# Altium schematic sheet 00_连接器和电源.SchDoc
size A4
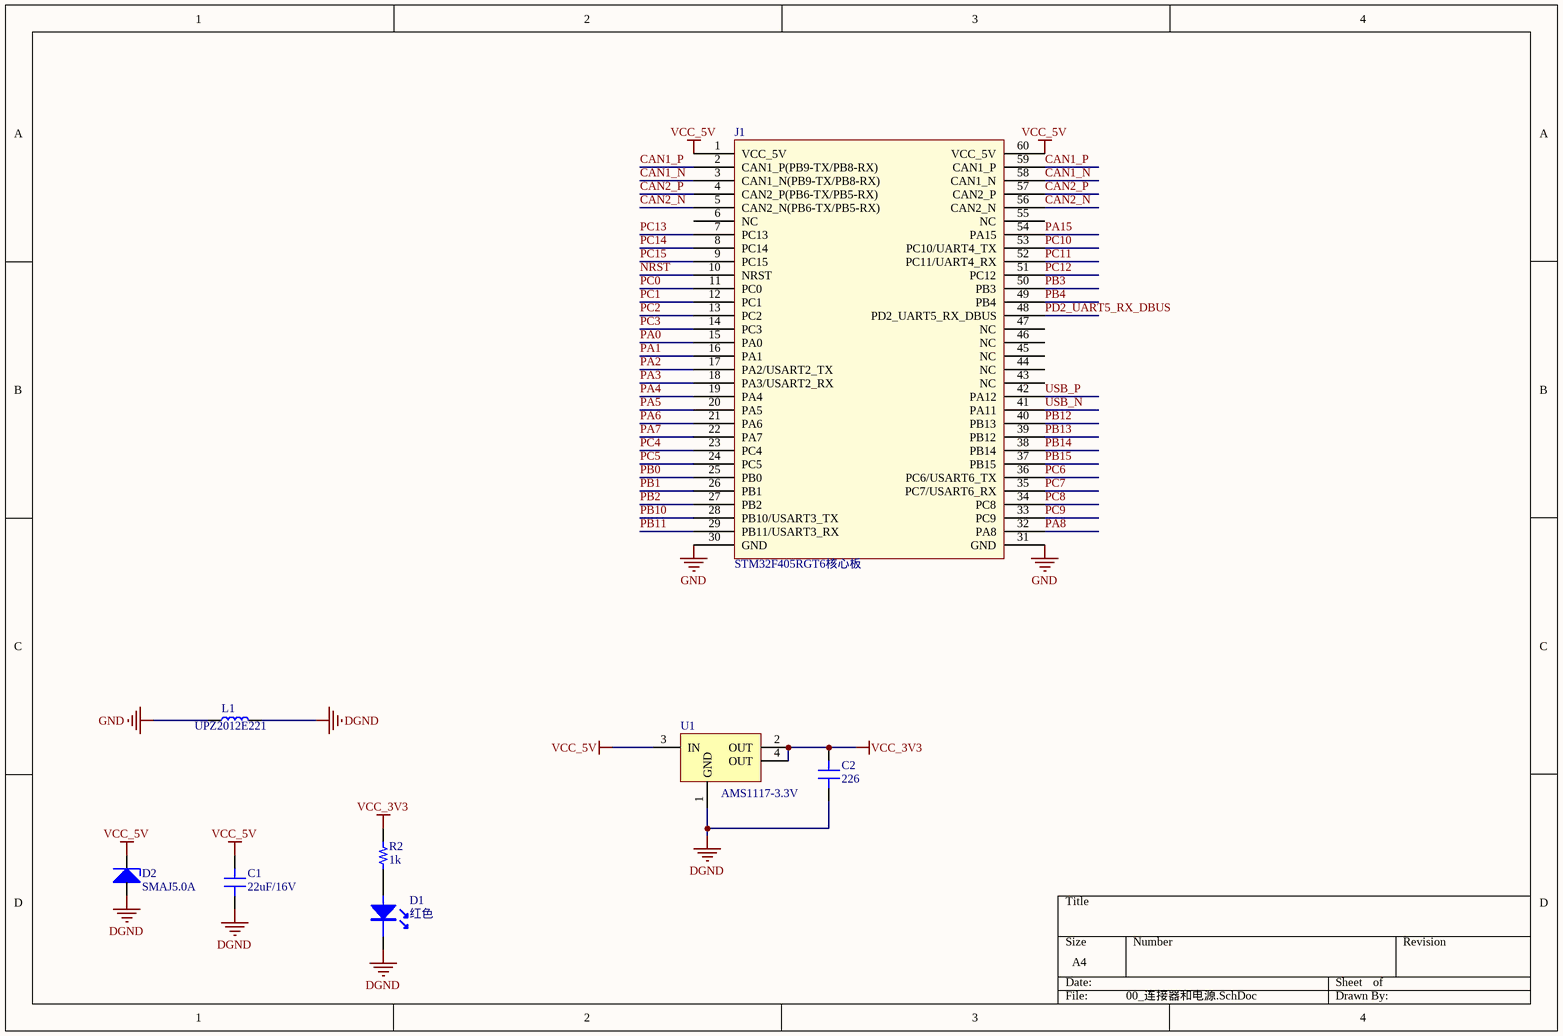
[diagram p0: 00_连接器和电源.SchDoc]

## Parts
C1  22uF/16V  [C1206/3216]
C2  226  [C0603/1608]
D1  Color: 红色  [LED0603-红色]  (hidden comment: LED-红色)
D2  SMAJ5.0A  [DO-214AC/SMA]
J1  STM32F405RGT6核心板  [3710M060037G0FR01]
L1  UPZ2012E221  [L0805/2012]
R2  1k  [R0603/1608]
U1  AMS1117-3.3V  [SOT-223]

## Nets
DGND: C1.1 C2.1 D1.2(K) D2.1(+) L1.2 U1.1(GND)
GND: J1.30(GND) J1.31(GND) L1.1
VCC_3V3: C2.2 R2.2 U1.2(OUT) U1.4(OUT)
VCC_5V: C1.2 D2.2(-) J1.1(VCC_5V) J1.60(VCC_5V) U1.3(IN)
CAN1_N: J1.3(CAN1_N(PB9-TX/PB8-RX)) J1.58(CAN1_N)
CAN1_P: J1.2(CAN1_P(PB9-TX/PB8-RX)) J1.59(CAN1_P)
CAN2_N: J1.5(CAN2_N(PB6-TX/PB5-RX)) J1.56(CAN2_N)
CAN2_P: J1.4(CAN2_P(PB6-TX/PB5-RX)) J1.57(CAN2_P)
NRST: J1.10(NRST)
PA0: J1.15(PA0)
PA1: J1.16(PA1)
PA2: J1.17(PA2/USART2_TX)
PA3: J1.18(PA3/USART2_RX)
PA4: J1.19(PA4)
PA5: J1.20(PA5)
PA6: J1.21(PA6)
PA7: J1.22(PA7)
PA8: J1.32(PA8)
PA15: J1.54(PA15)
PB0: J1.25(PB0)
PB1: J1.26(PB1)
PB2: J1.27(PB2)
PB3: J1.50(PB3)
PB4: J1.49(PB4)
PB10: J1.28(PB10/USART3_TX)
PB11: J1.29(PB11/USART3_RX)
PB12: J1.40(PB13)
PB13: J1.39(PB12)
PB14: J1.38(PB14)
PB15: J1.37(PB15)
PC0: J1.11(PC0)
PC1: J1.12(PC1)
PC2: J1.13(PC2)
PC3: J1.14(PC3)
PC4: J1.23(PC4)
PC5: J1.24(PC5)
PC6: J1.36(PC6/USART6_TX)
PC7: J1.35(PC7/USART6_RX)
PC8: J1.34(PC8)
PC9: J1.33(PC9)
PC10: J1.53(PC10/UART4_TX)
PC11: J1.52(PC11/UART4_RX)
PC12: J1.51(PC12)
PC13: J1.7(PC13)
PC14: J1.8(PC14)
PC15: J1.9(PC15)
PD2_UART5_RX_DBUS: J1.48(PD2_UART5_RX_DBUS)
USB_N: J1.41(PA11)
USB_P: J1.42(PA12)
NetD1_1: D1.1(A) R2.1

Not connected (* = marked no-connect by the designer): J1 6(NC) 43(NC) 44(NC) 45(NC) 46(NC) 47(NC) 55(NC)

## Library data of the parts
C1 C2 = 陶瓷电容
D1 = LED: 发光二极管
D2 = 瞬态抑制二极管
J1 = STM32F405RGT6核心板: 3710(F/M)060037G0FR01
L1 = 磁珠: 贴片磁珠
R2 = 电阻
U1 = AMS1117: AMS1117低压差线性稳压器